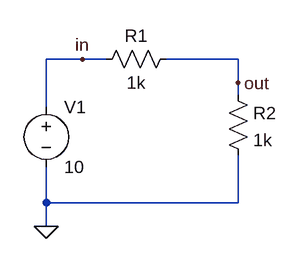
[diagram p0: schematic Task1.asc]
Task1.asc, the LTspice schematic file:
Version 4.1
SHEET 1 880 680
WIRE 32 48 -16 48
WIRE 64 48 32 48
WIRE 240 48 144 48
WIRE 240 80 240 48
WIRE 240 96 240 80
WIRE -16 112 -16 48
WIRE -16 240 -16 192
WIRE 240 240 240 176
WIRE 240 240 -16 240
WIRE -16 272 -16 240
FLAG -16 272 0
FLAG 240 80 out
FLAG 32 48 in
SYMBOL res 160 32 R90
WINDOW 0 0 56 VBottom 2
WINDOW 3 32 56 VTop 2
SYMATTR InstName R1
SYMATTR Value 1k
SYMBOL voltage -16 96 R0
SYMATTR InstName V1
SYMATTR Value 10
SYMBOL res 224 80 R0
SYMATTR InstName R2
SYMATTR Value 1k

The netlist it stands for:
* Task1.asc
R1 out in 1k
V1 in 0 10
R2 out 0 1k
.backanno
.end